# Altium schematic sheet IV_sensing.SchDoc: Triumvi - Sensing - IV Sensing
size Letter; Author: Ye-Sheng Kuo; Revision: 9; SheetNumber: 3; SheetTotal: 6
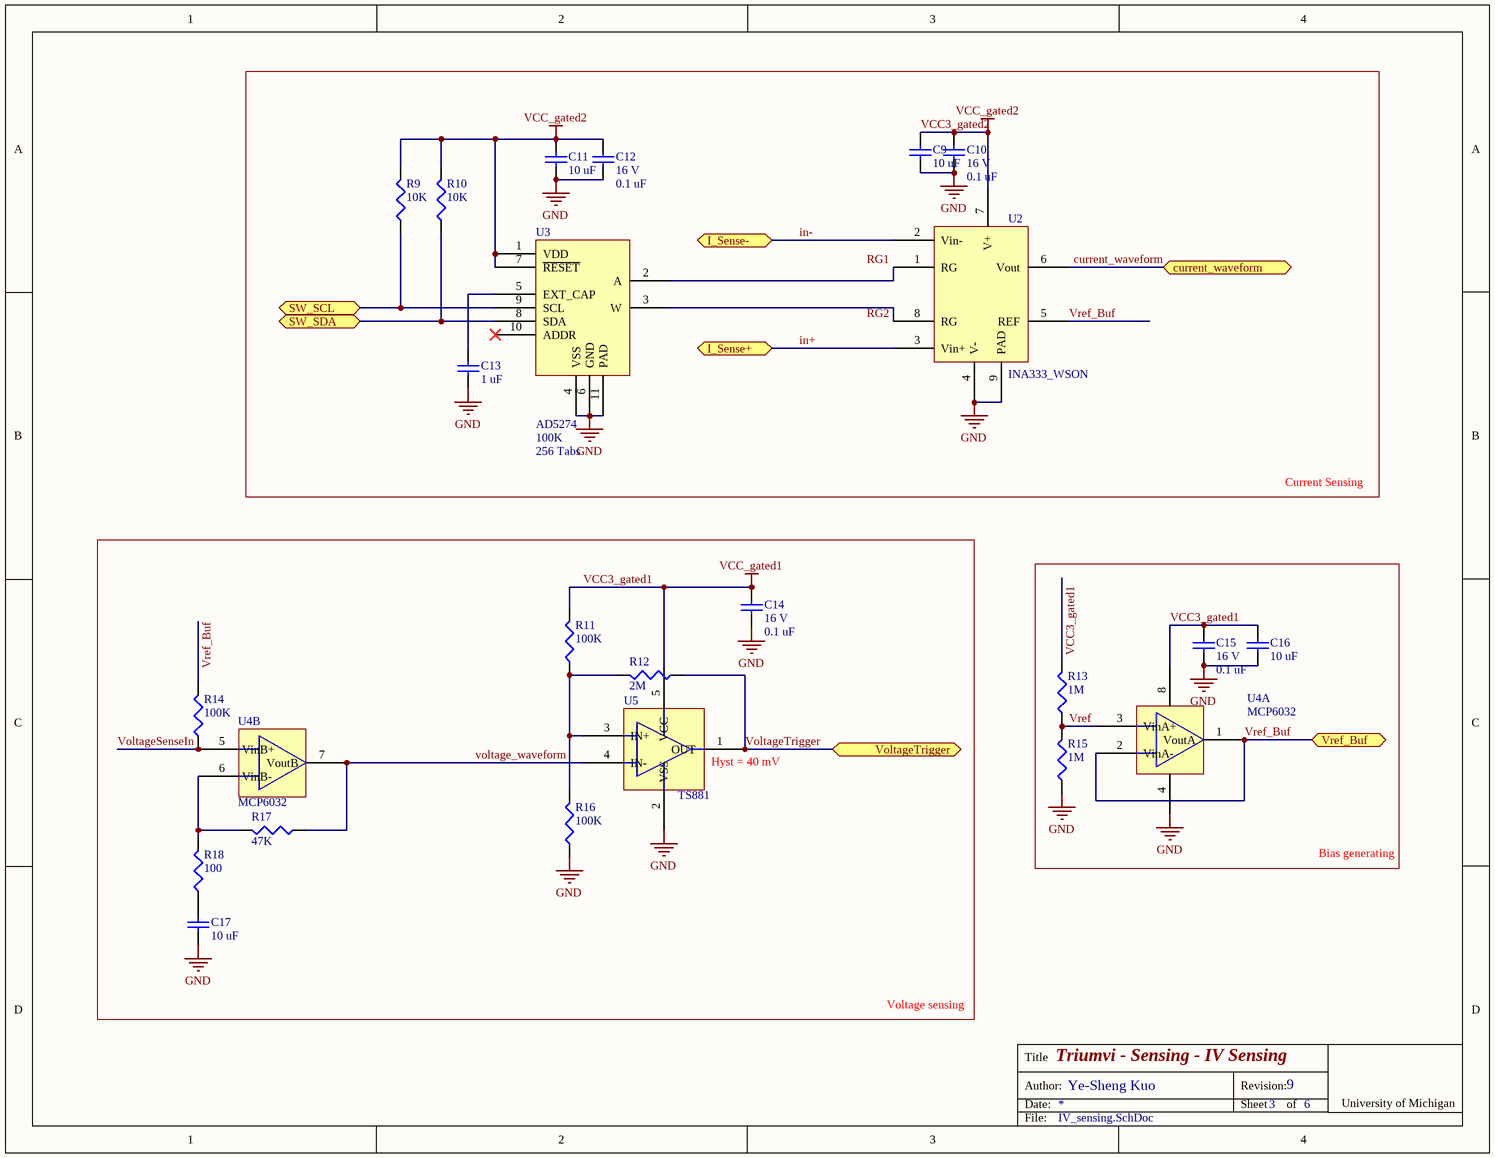
[diagram p0: IV_sensing.SchDoc]

## Parts
C9  value 10 uF  [0603]  (hidden comment: Ceramic capacitor)
C10  value 0.1 uF  voltage rated: 16 V  [0402]  (hidden comment: Ceramic capacitor)
C11  value 10 uF  [0603]  (hidden comment: Ceramic capacitor)
C12  value 0.1 uF  voltage rated: 16 V  [0402]  (hidden comment: Ceramic capacitor)
C13  value 1 uF  [0402]  (hidden comment: Ceramic capacitor)
C14  value 0.1 uF  voltage rated: 16 V  [0402]  (hidden comment: Ceramic capacitor)
C15  value 0.1 uF  voltage rated: 16 V  [0402]  (hidden comment: Ceramic capacitor)
C16  value 10 uF  [0603]  (hidden comment: Ceramic capacitor)
C17  value 10 uF  [0603]  (hidden comment: Ceramic capacitor)
R9  value 10K  [0402]  (hidden comment: Chip resistor)
R10  value 10K  [0402]  (hidden comment: Chip resistor)
R11  value 100K  [0402]  (hidden comment: Chip resistor)
R12  value 2M  [0402]  (hidden comment: Chip resistor)
R13  value 1M  [0402]  (hidden comment: Chip resistor)
R14  value 100K  [0402]  (hidden comment: Chip resistor)
R15  value 1M  [0402]  (hidden comment: Chip resistor)
R16  value 100K  [0402]  (hidden comment: Chip resistor)
R17  value 47K  [0402]  (hidden comment: Chip resistor)
R18  value 100  [0402]  (hidden comment: Chip resistor)
U2  INA333_WSON  [WSON-8]
U3  AD5274  value 100K  [LFCSP_WD]
U4  MCP6032  [MSOP-8]  (parts A,B of 2)
U5  TS881  [SC70-5]

## Blocks framed on the sheet
Current Sensing: C9-C13 R9 R10 U2 U3
Bias generating: C15 C16 R13 R15 U4

## Ports
current_waveform, I_Sense+, I_Sense-, SW_SCL, SW_SDA, VoltageTrigger, Vref_Buf

## Nets
GND: C9.2 C10.2 C11.2 C12.2 C13.2 C14.2 C15.2 C16.2 C17.2 R15.2 R16.2 U2.4(V-) U2.9(PAD) U3.4(VSS) U3.6(GND) U3.11(PAD) U4.4(VSS) U5.2(VSS)
VCC3_gated1: C14.1 C15.1 C16.1 R11.1 R13.1 U4.8(VDD) U5.5(VCC)  [also labelled VCC_gated1]
VCC3_gated2: C9.1 C10.1 C11.1 C12.1 R9.1 R10.1 U2.7(V+) U3.1(VDD) U3.7(~{RESET})  [also labelled VCC_gated2]
current_waveform: U2.6(Vout) ; port current_waveform
in+: U2.3(Vin+) ; port I_Sense+
in-: U2.2(Vin-) ; port I_Sense-
SW_SCL: R9.2 U3.9(SCL) ; port SW_SCL
SW_SDA: R10.2 U3.8(SDA) ; port SW_SDA
voltage_waveform: R17.2 U4.7(VoutB) U5.4(IN-)
VoltageSenseIn: R14.2 U4.5(VinB+)
VoltageTrigger: R12.2 U5.1(OUT) ; port VoltageTrigger
Vref: R13.2 R15.1 U4.3(VinA+)
Vref_Buf: R14.1 U2.5(REF) U4.1(VoutA) U4.2(VinA-) ; port Vref_Buf
NetC13_1: C13.1 U3.5(EXT_CAP)
NetC17_1: C17.1 R18.2
NetR11_2: R11.2 R12.1 R16.1 U5.3(IN+)
NetR17_1: R17.1 R18.1 U4.6(VinB-)
NetU2_1: U2.1(RG) U3.2(A)
NetU2_8: U2.8(RG) U3.3(W)

Not connected (* = marked no-connect by the designer): U3 10(ADDR)*

## Notes on the sheet
- (near U5) Hyst = 40 mV
- Voltage sensing
- Labels drawn without touching a wire or pin: RG1, RG2
- Title
- Date:
- Author:
- Revision:
- Sheet
- of
- University of Michigan
- File:
- (in symbol AD5274) 256 Tabs

## Library data of the parts
C9 C11 C16 C17 = C_10u_6.3V_0603_ceramic: Ceramic capacitor, 10 uF, 0603 package; Manufacture: TDK; voltage rated: 6.3V; tolerance: 20%; package: 0603; Supplier 1: Digi-Key; Supplier Part Number 1: 445-4112-1-ND
C10 C12 C14 C15 = C_0.1u_16V_0402_ceramic: Ceramic capacitor, 0.1u, 16 V, 0402 package; Manufacture: Murata; tolerance: 10%; Temperature Coef: X7R; package: 0402; Supplier 1: Digi-Key; Supplier Part Number 1: 490-3261-1-ND
C13 = C_1u_16V_0402_ceramic: Ceramic capacitor, 1 uF, 16V, 0402 package; Manufacture: TDK; tolerance: 10%; Temperature rating: X5R; voltage rated: 16 V; package: 0402; Supplier 1: Digi-Key; Supplier Part Number 1: 445-4978-1-ND
R9 R10 = R_10K_0402: Chip resistor, 10K, 0402 package; tolerance: 1%; power: 1/16 W; Supplier 1: Digi-Key; Supplier Part Number 1: 541-10.0KLCT-ND; package: 0402
R11 R14 R16 = R_100K_0402: Chip resistor, 100K, 0402 package; tolerance: 1%; power: 1/16 W; Supplier 1: Digi-Key; Supplier Part Number 1: 541-100KLCT-ND; package: 0402
R12 = R_2M_0402: Chip resistor, 2M, 0402 package; tolerance: 1%; power: 1/16 W; package: 0402; Supplier 1: Digi-Key; Supplier Part Number 1: 541-2.00MLCT-ND
R13 R15 = R_1M_0402: Chip resistor, 1M, 0402 package; tolerance: 1%; power: 1/16 W; Supplier 1: Digi-Key; Supplier Part Number 1: 541-1.00MLCT-ND; package: 0402
R17 = R_47K_0402: Chip resistor, 47K, 0402 package; tolerance: 1%; power: 1/16 W; package: 0402; Supplier 1: Digi-Key; Supplier Part Number 1: 541-47.0KLCT-ND
R18 = R_100_0402: Chip resistor, 100, 0402 package; tolerance: 1%; power: 1/16 W; package: 0402; Supplier 1: Digi-Key; Supplier Part Number 1: 541-100LCT-ND
U2 = INA333_WSON: Micro-Power (50µA), Zerø-Drift, Rail-to-Rail Out  Instrumentation Amplifier; Supplier 1: Digi-Key; Supplier Part Number 1: 296-41266-1-ND
U3 = AD5274: 1024-/256-Position, 1% Resistor Tolerance Error, I2C Interface and 50-TP Memory Digital Rheostat; Supplier 1: Digi-Key; Supplier Part Number 1: AD5274BCPZ-100-RL7CT-ND
U4 = MCP6032: 0.9 µA, High Precision Op Amps; Supplier 1: Digi-Key; Supplier Part Number 1: MCP6032-E/MS-ND
U5 = TS881: Rail-to-rail 0.9 V nanopower comparator; Supplier 1: Digi-Key; Supplier Part Number 1: 497-13217-1-ND